# Altium schematic sheet 01.SchDoc
size 386 x 246 mm
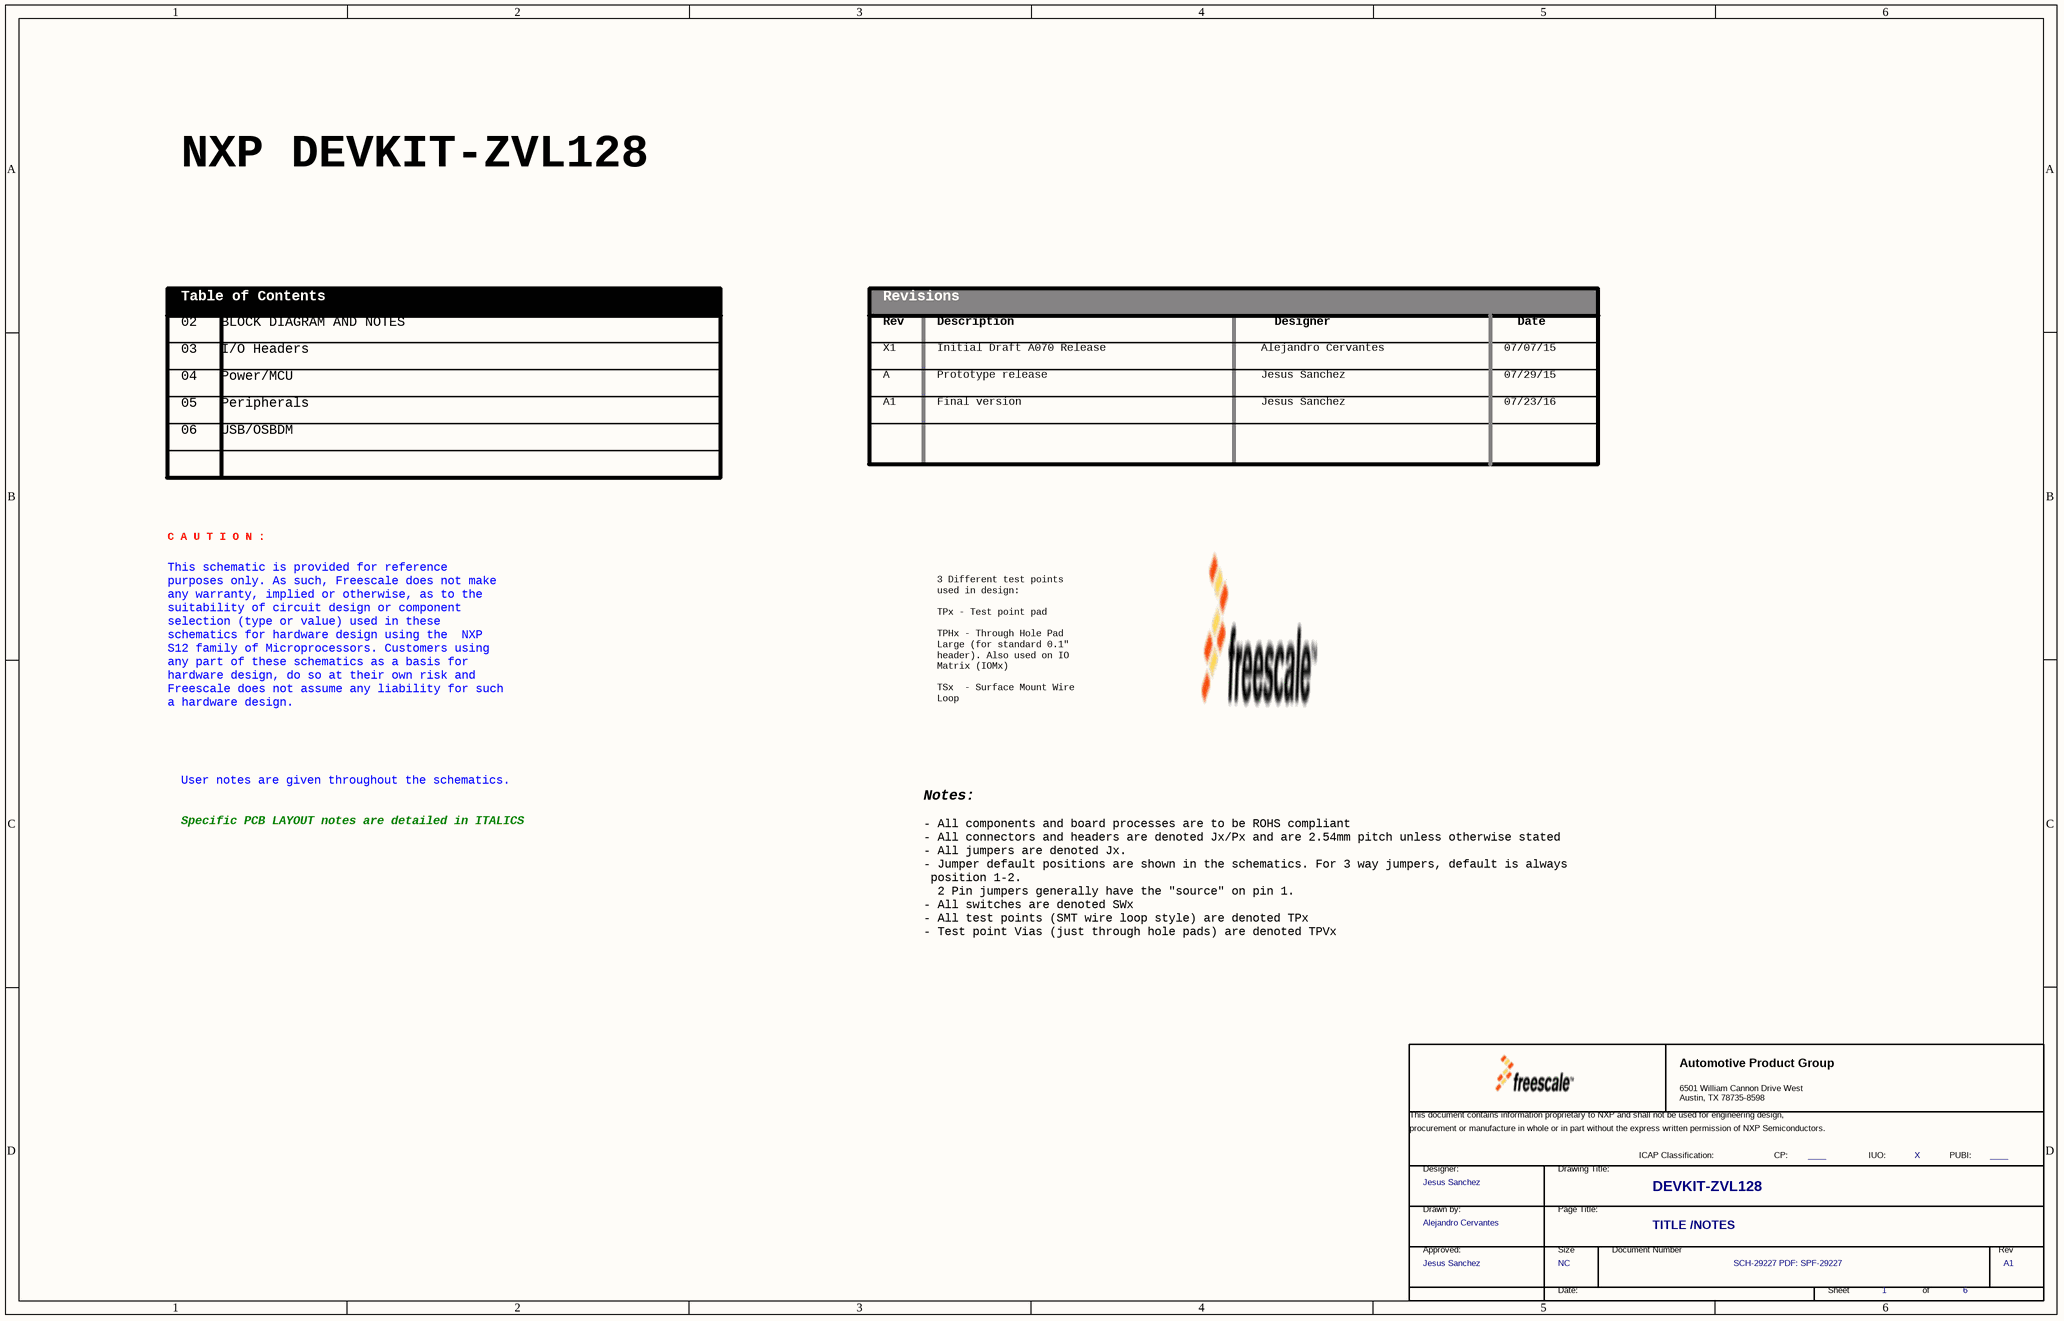
[diagram p0: 01.SchDoc]

## Parts
*  FCP: ____  FIUO: X  DrawnBy: Alejandro Cervantes  Approver: Jesus Sanchez  PageTitle: TITLE /NOTES  Page Count: 6  Page Number: 1  Page Size: NC  Title: DEVKIT-ZVL128  RevCode: A1  Doc: SCH-29227 PDF: SPF-29227  (hidden comment: TitleBlock_AMPG)  (graphical)

## Notes on the sheet
- NXP DEVKIT-ZVL128
- Table of Contents
- 02   BLOCK DIAGRAM AND NOTES
- Revisions
- Rev
- Description
- Designer
- Date
- 03   I/O Headers
- 04   Power/MCU
- X1
- A
- Initial Draft A070 Release
- Prototype release
- Alejandro Cervantes
- Jesus Sanchez
- 07/07/15
- 07/29/15
- 06   USB/OSBDM
- 05   Peripherals
- A1
- Final version
- 07/23/16
- This schematic is provided for reference
  purposes only. As such, Freescale does not make
  any warranty, implied or otherwise, as to the
  suitability of circuit design or component
  selection (type or value) used in these
  schematics for hardware design using the  NXP
  S12 family of Microprocessors. Customers using
  any part of these schematics as a basis for
  hardware design, do so at their own risk and
  Freescale does not assume any liability for such
  a hardware design.
- C A U T I O N :
- 3 Different test points
  used in design:
  TPx - Test point pad
  TPHx - Through Hole Pad
  Large (for standard 0.1"
  header). Also used on IO
  Matrix (IOMx)
  TSx  - Surface Mount Wire
  Loop
- User notes are given throughout the schematics.
- Notes:
- Specific PCB LAYOUT notes are detailed in ITALICS
- - All components and board processes are to be ROHS compliant
  - All connectors and headers are denoted Jx/Px and are 2.54mm pitch unless otherwise stated
  - All jumpers are denoted Jx.
  - Jumper default positions are shown in the schematics. For 3 way jumpers, default is always
  position 1-2.
  2 Pin jumpers generally have the "source" on pin 1.
  - All switches are denoted SWx
  - All test points (SMT wire loop style) are denoted TPx
  - Test point Vias (just through hole pads) are denoted TPVx
- (in symbol TitleBlock_AMPG) Automotive Product Group; 6501 William Cannon Drive West / Austin, TX 78735-8598; This document contains information proprietary to NXP and shall not be used for engineering design,; procurement or manufacture in whole or in part without the express written permission of NXP Semiconductors.; ICAP Classification:; CP:; IUO:; PUBI:; Designer:; Drawing Title:; Drawn by:; Page Title:; Approved:; Size; Document Number; Rev; Date:; Sheet; of

## Library data of the parts
* = TitleBlock_AMPG: OrgName: Freescale Semiconductor; OrgAddr1: 6501 William Cannon Drive West; OrgAddr2: Austin, TX 78735-8598; PUBI: ____; Designer: Jesus Sanchez; Page Create Date: March  8, 1995